# EAGLE design ESP32-S2_pacman (EAGLE 6.5.0)
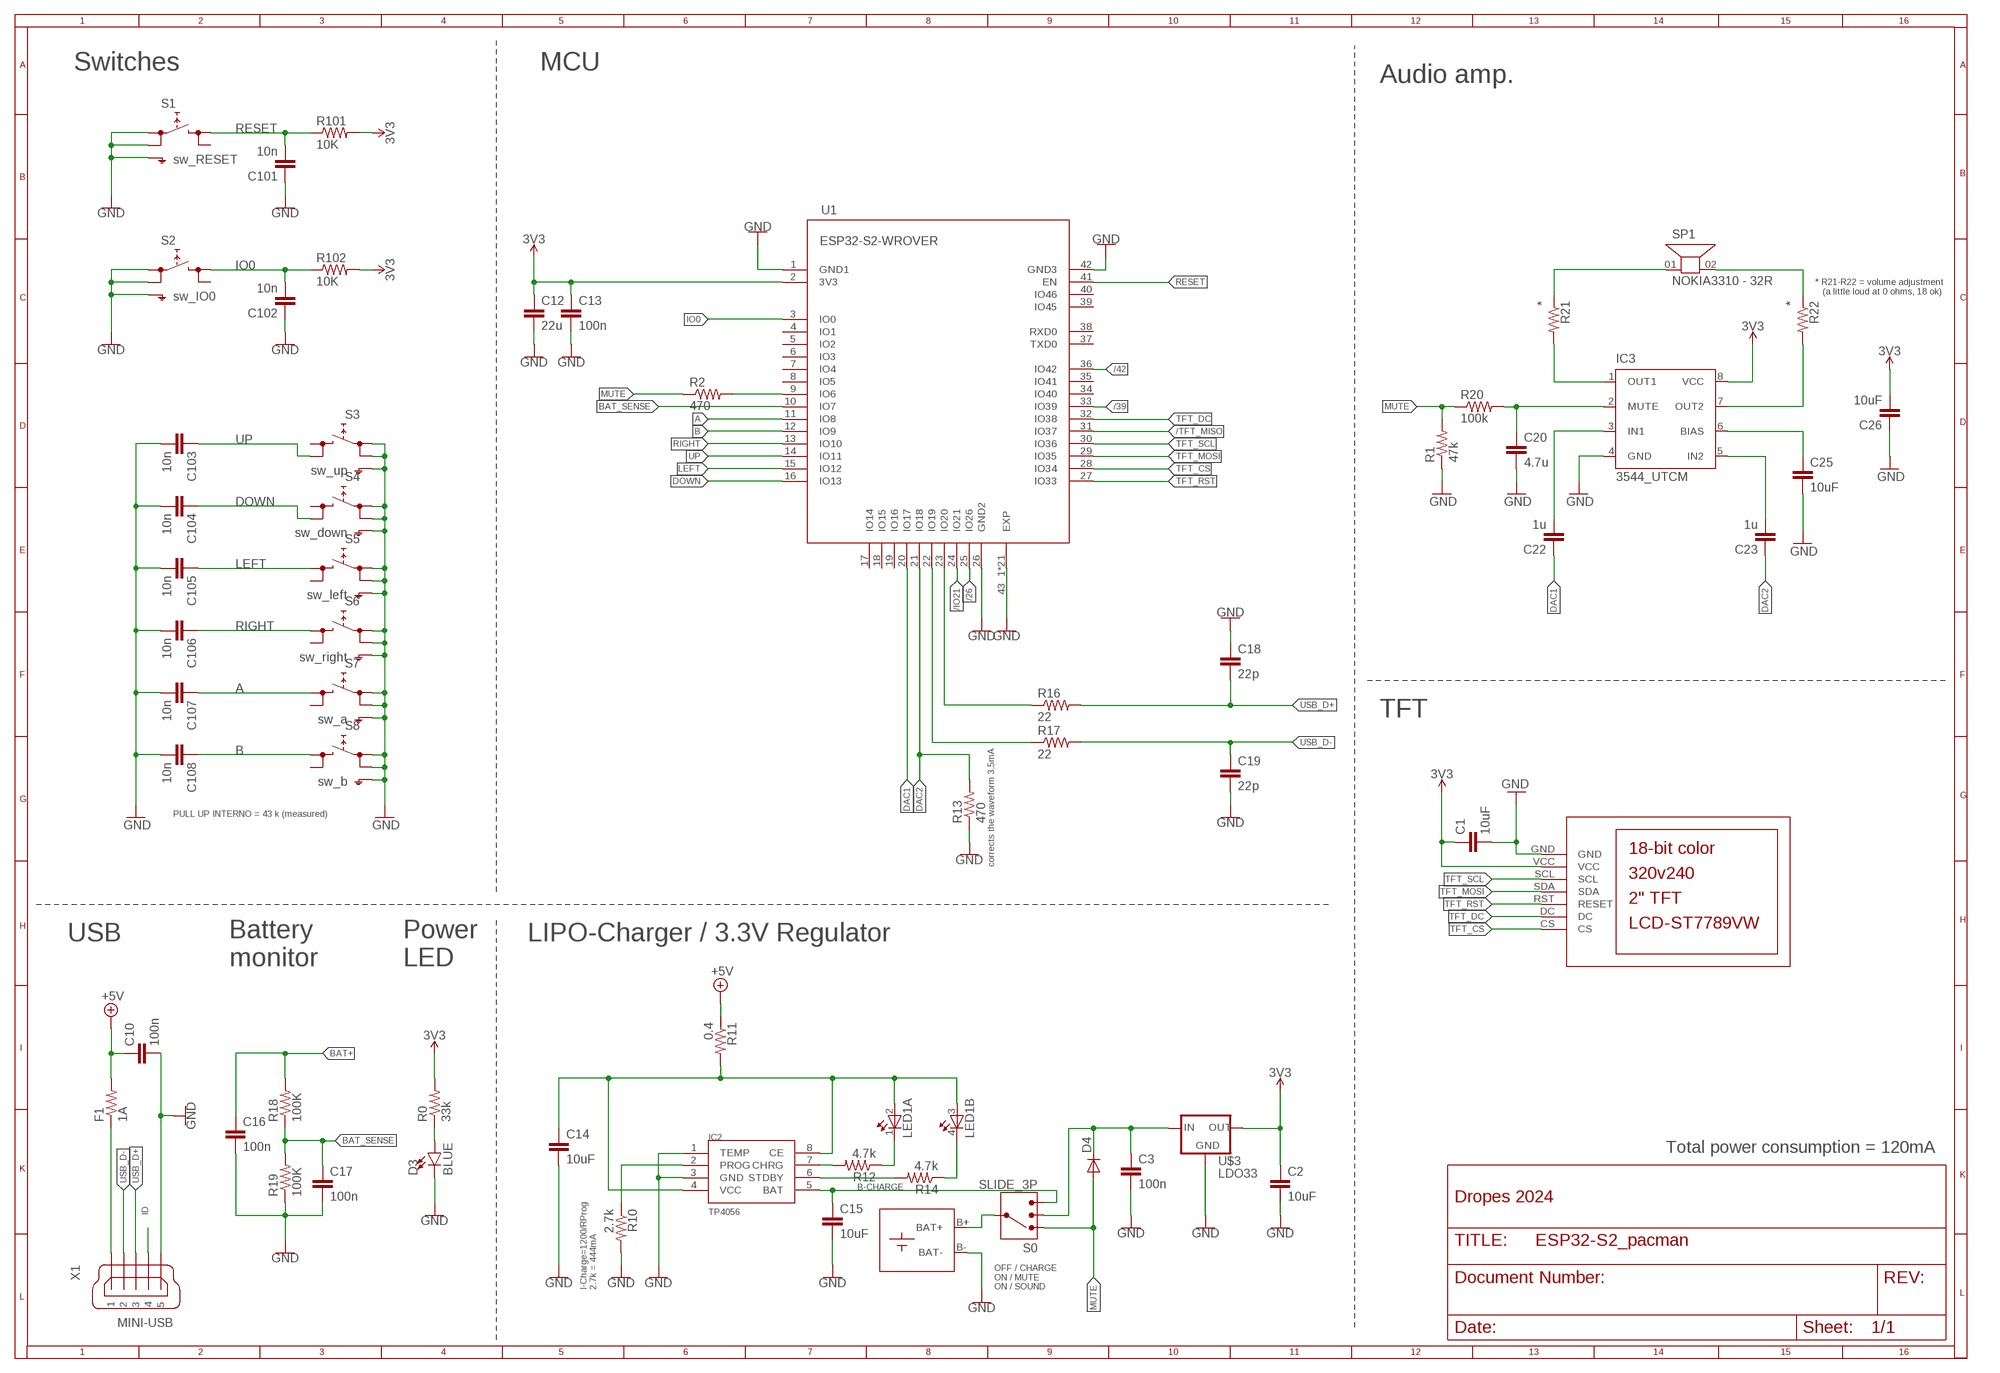
[diagram p0: schematic, sheet 1]

## Parts
C1  10uF  CAP1206  [1206]
C2  10uF  CAP1206  [1206]
C3  100n  CAP0805  [0805]
C10  100n  CAP0805  [0805]
C12  22u  CAP1206  [1206]
C13  100n  CAP0805  [0805]
C14  10uF  CAP1206  [1206]
C15  10uF  CAP1206  [1206]
C16  100n  CAP0805  [0805]
C17  100n  CAP0805  [0805]
C18  22p  CAP0805  [0805]
C19  22p  CAP0805  [0805]
C20  4.7u  CAP0805  [0805]
C22  1u  CAP0805  [0805]
C23  1u  CAP0805  [0805]
C25  10uF  CAP0805  [0805]
C26  10uF  CAP0805  [0805]
C101  10n  CAP0805  [0805]
C102  10n  CAP0805  [0805]
C103  10n  CAP0805  [0805]
C104  10n  CAP0805  [0805]
C105  10n  CAP0805  [0805]
C106  10n  CAP0805  [0805]
C107  10n  CAP0805  [0805]
C108  10n  CAP0805  [0805]
D3  BLUE  LED-BLUE1206  [LED-1206]
D4  DIODE-SOD323-W  [SOD323-W]
F1  1A  RESISTOR0805-RES  [0805]
IC2  TP4056  [SOP-8]
IC3  3544_UTCM  [SO08]
LED1  TOPLED-2--  [P-LCC-4-2]
R0  33k  RESISTOR0805-RES  [0805]
R1  47k  RESISTOR0805-RES  [0805]
R2  470  RESISTOR0805-RES  [0805]
R10  2.7k  RESISTOR0805-RES  [0805]
R11  0.4  RESISTOR0805-RES  [0805]
R12  4.7k  RESISTOR0805-RES  [0805]
R13  470  RESISTOR0805-RES  [0805]
R14  4.7k  RESISTOR0805-RES  [0805]
R16  22  RESISTOR0805-RES  [0805]
R17  22  RESISTOR0805-RES  [0805]
R18  100K  RESISTOR0805-RES  [0805]
R19  100K  RESISTOR0805-RES  [0805]
R20  100k  RESISTOR0805-RES  [0805]
R21  *  RESISTOR0805-RES  [0805]
R22  *  RESISTOR0805-RES  [0805]
R101  10K  RESISTOR0805-RES  [0805]
R102  10K  RESISTOR0805-RES  [0805]
S0  SLIDE_3P  [SLIDE_3P]
S1  sw_RESET  SKHMPSE010  [SKHMPXE010]
S2  sw_IO0  SKHMPSE010  [SKHMPXE010]
S3  sw_up  SKHMPSE010  [SKHMPXE010]
S4  sw_down  SKHMPSE010  [SKHMPXE010]
S5  sw_left  SKHMPSE010  [SKHMPXE010]
S6  sw_right  SKHMPSE010  [SKHMPXE010]
S7  sw_a  SKHMPSE010  [SKHMPXE010]
S8  sw_b  SKHMPSE010  [SKHMPXE010]
SP1  NOKIA3310 - 32R  AL201P  [AL201P]
U1  ESP32-S2-WROVER  [MODULE_ESP32-S2-WROVER]
U$1  NOKIA_LIPO  [BATTERY]
U$2  LCD-ST7789VW  [LCD-ST7789VW]
U$3  LDO33  [SOT89R]
X1  MINI-USB  MINI-USB-32005-301  [32005-301]

## Nets
+5V [+5V]: C10.1 F1.2 R11.1
/26: U1.25(IO26)
/39: U1.33(IO39)
/42: U1.36(IO42)
/IO21: U1.24(IO21)
/TFT_MISO: U1.31(IO37)
A: C107.1 S7.3(2.1) U1.11(IO8)
B: C108.1 S8.3(2.1) U1.12(IO9)
B-CHARGE [3V3]: C15.1 IC2.5(BAT) S0.P$4
BAT+ [3V3]: C16.1 R18.2 S0.P$1 U$1.B+(BAT+)
BAT++: C3.1 D4.C S0.P$3 U$3.2(IN) U$3.'2(IN)
BAT_SENSE: C17.1 R18.1 R19.2 U1.10(IO7)
DAC1: C22.1 U1.20(IO17)
DAC2: C23.1 R13.2 U1.21(IO18)
DOWN: C104.1 S4.4(2.2) U1.16(IO13)
GND [GND]: C1.2 C2.2 C3.2 C10.2 C12.2 C13.2 C14.2 C15.2 C16.2 C17.2 C18.1 C19.2 C20.2 C25.2 C26.1 C101.1 C102.1 C103.2 C104.2 C105.2 C106.2 C107.2 C108.2 D3.C IC2.1(TEMP) IC2.3(GND) IC3.4(GND) R1.1 R10.2 R13.1 R19.1 S1.1(1.1) S1.2(1.2) S1.5(SH) S2.1(1.1) S2.2(1.2) S2.5(SH) S3.1(1.1) S3.2(1.2) S3.5(SH) S4.1(1.1) S4.2(1.2) S4.5(SH) S5.1(1.1) S5.2(1.2) S5.5(SH) S6.1(1.1) S6.2(1.2) S6.5(SH) S7.1(1.1) S7.2(1.2) S7.5(SH) S8.1(1.1) S8.2(1.2) S8.5(SH) U1.1(GND1) U1.26(GND2) U1.42(GND3) U1.43_1(EXP) U1.43_2(EXP) U1.43_3(EXP) U1.43_4(EXP) U1.43_5(EXP) U1.43_6(EXP) U1.43_7(EXP) U1.43_8(EXP) U1.43_9(EXP) U1.43_10(EXP) U1.43_11(EXP) U1.43_12(EXP) U1.43_13(EXP) U1.43_14(EXP) U1.43_15(EXP) U1.43_16(EXP) U1.43_17(EXP) U1.43_18(EXP) U1.43_19(EXP) U1.43_20(EXP) U1.43_21(EXP) U$1.B-(BAT-) U$2.GND U$3.1(GND) X1.5
ID: X1.4
IN1: C22.2 IC3.3(IN1)
IO0: C102.2 R102.1 S2.3(2.1) U1.3(IO0)
IO52: R16.1 U1.23(IO20)
IO53: R17.1 U1.22(IO19)
LEFT: C105.1 S5.3(2.1) U1.15(IO12)
MUTE [3V3]: D4.A R1.2 R2.1 R20.1 S0.P$2
N$1: R21.1 SP1.01
N$2: D3.A R0.1
N$4: C20.1 IC3.2(MUTE) R20.2
N$6: R2.2 U1.9(IO6)
N$19: R22.1 SP1.02
N$31: IC3.1(OUT1) R21.2
N$32: C25.1 IC3.6(BIAS)
N$33: IC3.7(OUT2) R22.2
N$34: C23.2 IC3.5(IN2)
N$38: IC2.2(PROG) R10.1
N$39: IC2.7(CHRG) R12.2
N$40: IC2.6(STDBY) R14.2
N$41: LED1.1(A:C) R12.1
N$42: LED1.4(B:C) R14.1
N$43: C14.1 IC2.4(VCC) IC2.8(CE) LED1.2(A:A) LED1.3(B:A) R11.2
RESET: C101.2 R101.1 S1.3(2.1) U1.41(EN)
RIGHT: C106.1 S6.3(2.1) U1.13(IO10)
TFT_CS: U1.28(IO34) U$2.CS
TFT_DC: U1.32(IO38) U$2.DC
TFT_MOSI: U1.29(IO35) U$2.SDA
TFT_RST: U1.27(IO33) U$2.RST(RESET)
TFT_SCL: U1.30(IO36) U$2.SCL
UP: C103.1 S3.4(2.2) U1.14(IO11)
USB+ [+5V]: F1.1 X1.1
USB_D+: C18.2 R16.2 X1.3
USB_D-: C19.1 R17.2 X1.2
VCC [3V3]: C1.1 C2.1 C12.1 C13.1 C26.2 IC3.8(VCC) R0.2 R101.2 R102.2 U1.2(3V3) U$2.VCC U$3.3(OUT) ; supply symbol labelled 3V3
Unconnected: S1.4(2.2) S2.4(2.2) S3.3(2.1) S4.3(2.1) S5.4(2.2) S6.4(2.2) S7.4(2.2) S8.4(2.2) U1.4(IO1) U1.5(IO2) U1.6(IO3) U1.7(IO4) U1.8(IO5) U1.17(IO14) U1.18(IO15) U1.19(IO16) U1.34(IO40) U1.35(IO41) U1.37(TXD0) U1.38(RXD0) U1.39(IO45) U1.40(IO46)

## Notes on the sheet
- Switches | MCU
- Audio amp.
- * R21-R22 = volume adjustment
     (a little loud at 0 ohms, 18 ok)
- TFT
- PULL UP INTERNO = 43 k (measured)
- corrects the waveform 3.5mA
- USB | LIPO-Charger / 3.3V Regulator
- Battery
  monitor
- Power
  LED
- Total power consumption = 120mA
- Dropes 2024
- I-Charge=1200/RProg
  2.7k = 444mA
- OFF / CHARGE
  ON / MUTE
  ON / SOUND

## Library data of the parts
C1-C3 C10 C12-C20 C22 C23 C25 C26 C101-C108 = SparkFun:CAP: Capacitor Standard 0603 ceramic capacitor, and 0.1" leaded capacitor.
D3 = SparkFun-LED:LED-BLUE: Blue SMD LED Used in manufacturing of various products at SparkFun Packages: 0603 - SMD 0603 package [Product Link] <http://www.digikey.com/product-detail/en/SMLE12BC7TT86/511-1589-2-ND/1641808> 1206 - SMD1206 package [Product Link] <http://www.digikey.com/product-detail/en/lite-on-inc/LTST-C150TBKT/160-1643-1-ND/573584> SparkFun Products: ESP8266 Thing-Dev Board <https://www.sparkfun.com/products/13711> RedBoard <https://www.sparkfun.com/products/12757>; PROD_ID: DIO-09911
D4 = diode:DIODE-: DIODE
F1 R0 R1 R2 R10-R14 R16-R22 R101 R102 = SparkFun:RESISTOR: Resistor Basic schematic elements and footprints for 0603, 1206, and PTH resistors.
IC2 = TP4056:TP4056
IC3 = 3544_UTC:3544_UTC: Dual headphone amplifie Source: https://datasheetspdf.com/pdf-file/577610/UTC/3544/1
LED1 = led:TOPLED-2-: Multi TOPLED® (two color) LG T672, LP T672 LSY T67B LSW T67C LSY T675 LSY T676 LSG T677 LSG T770 Source: http://www.osram.convergy.de/
S0 = switch:SLIDE_3P
S1-S8 = switch:SKHMP*E010: 6.2 X 6.5mm TACT Switch (SMD) Source: http://www3.alps.co.jp/WebObjects/catalog.woa/PDF/E/Switch/Tact/SKHM/SKHM.PDF
SP1 = buzzer:AL201P: SPEAKER Source: Buerklin; OC_FARNELL: unknown; OC_NEWARK: unknown
U1 = ESP32-S2-WROVER v-real:ESP32-S2-WROVER: WiFi 802.11b/g/n Transceiver Module 2.4GHz Antenna Not Included Surface Mount Check prices <https://pricing.snapeda.com/parts/ESP32-S2-WROVER/Espressif%20Systems/view-part?ref=eda>; AVAILABILITY: Bad; DESCRIPTION: WiFi 802.11b/g/n Transceiver Module 2.4GHz Antenna Not Included Surface Mount; MF: Espressif Systems; MP: ESP32-S2-WROVER; PACKAGE: VFQFN-56 Espressif Systems; PRICE: None
U$1 = dropes:NOKIA_LIPO
U$2 = galvo 6:LCD-ST7789VW
U$3 = v-reg:LDO33
X1 = m140_attiny_V5:MINI-USB-: MINI USB-B Conector Source: www.cypressindustries.com; OC_FARNELL: unknown; OC_NEWARK: unknown

## Net classes
1 VBUS: width 0.61 mm
2 3V3: width 0.61 mm
3 VCC: width 0.61 mm
4 GND: width 0.406 mm
5 +5V: width 0.61 mm

## Board
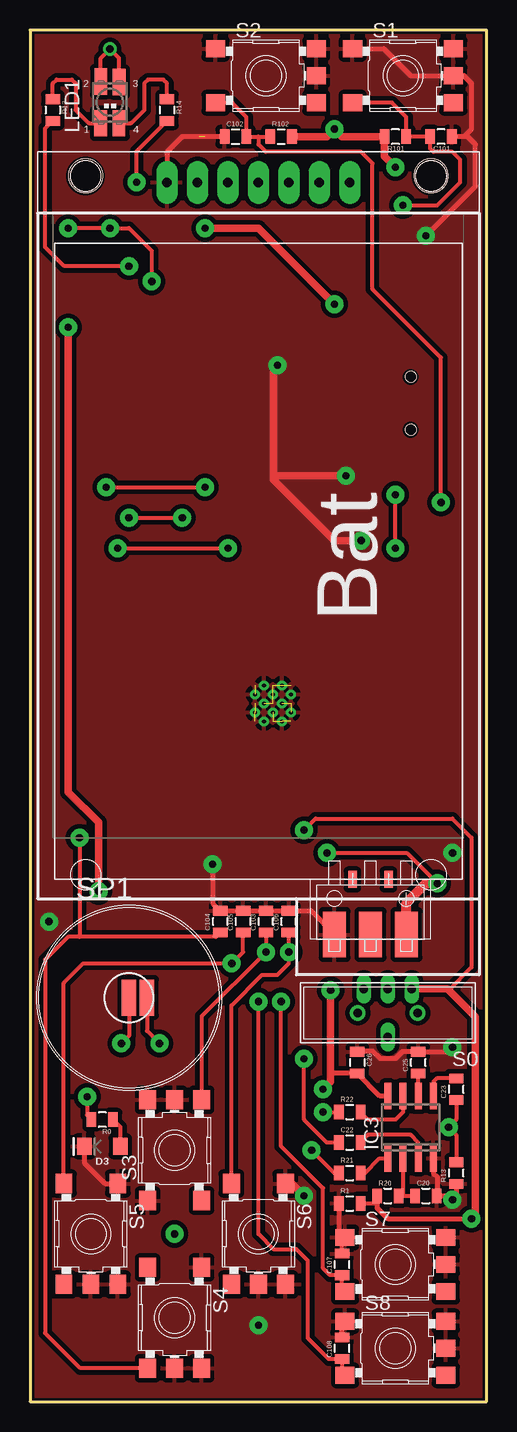
[diagram p1: board, top side]
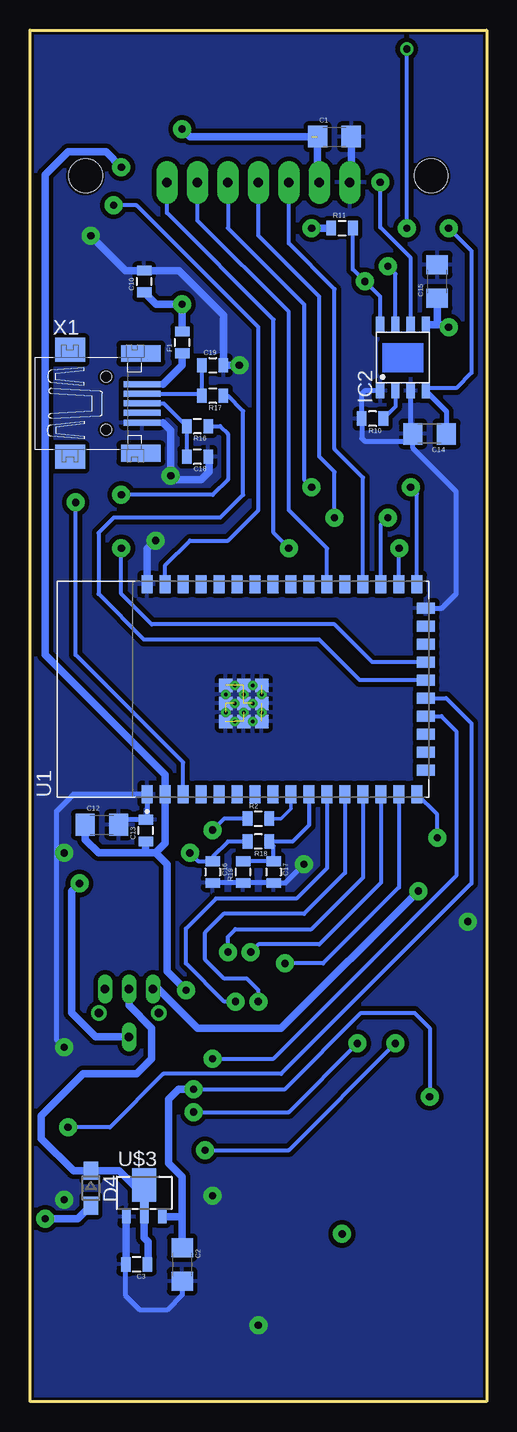
[diagram p2: board, bottom side, seen from below]

Size 38.1 x 114.3 mm. Coordinates in mm from the lower left corner, seen from the top.
Outline: 38.1,0 38.1,114.3 0,114.3 0,0 38.1,0
Copper layers (1*16): Top 0.035mm / dielectric 1.5mm / Bottom 0.035mm
Design rules "SparkFun-2-layer-STANDARD *": minimum track width 10mil, minimum drill 20mil, track to track 15mil, track to pad 15mil, pad to pad 15mil, via to via 15mil, smd to smd 8mil, copper to edge 8mil, drill to drill 8mil, minimum pad ring 10mil, minimum via ring 10mil, stop-mask expansion 4mil, vias tented up to drill 25mil, thermal gap 15mil
Holes 2.8 mm at 4.64,102.15 33.46,102.15

### Footprints (pad centres in the part's own frame; a part is rotated, then mirrored left to right if it is on the bottom)
1206 = smd 1.6 x 1.8: 1 -1.4,0; 2 1.4,0
0805 = smd 0.8 x 1.2: 1 -0.9,0; 2 0.9,0
LED-1206 = smd 1.2 x 1.4: A -1.5,0; C 1.5,0
SOD323-W = smd 1.5 x 1.2: A 1.45,0; C -1.45,0
SOP-8 = smd 1.3 x 0.7: 1 -2.75,1.905; 2 -2.75,0.635; 3 -2.75,-0.635; 4 -2.75,-1.905; 5 2.75,-1.905; 6 2.75,-0.635; 7 2.75,0.635; 8 2.75,1.905
SO08 = smd 0.6 x 2.2: 1 -1.905,-2.6; 2 -0.635,-2.6; 3 0.635,-2.6; 4 1.905,-2.6; 5 1.905,2.6; 6 0.635,2.6; 7 -0.635,2.6; 8 -1.905,2.6
P-LCC-4-2 = smd 1.067 x 2.184: 1 -0.76,-1.73; 2 -0.755,1.735; 3 0.76,1.7; 4 0.75,-1.73
SLIDE_3P = drill 0.7 long: P$1 0,2; P$2 -2,-2; P$3 0,-2; P$4 2,-2 | drill 0.7 pad 1.3: P$5 -2.5,0; P$6 2.5,0
SKHMPXE010 = smd 1.6 x 1.4: 1 -4.2,2.25; 2 4.2,2.25; 3 -4.2,-2.25; 4 4.2,-2.25; 5 4.2,0
AL201P = smd 1.2 x 3: 01 0,0; 02 1.5,0
MODULE_ESP32-S2-WROVER = smd 1.5 x 0.9: 1 -8.75,8; 2 -8.75,6.5; 3 -8.75,5; 4 -8.75,3.5; 5 -8.75,2; 6 -8.75,0.5; 7 -8.75,-1; 8 -8.75,-2.5; 9 -8.75,-4; 10 -8.75,-5.5; 11 -8.75,-7; 12 -8.75,-8.5; 13 -8.75,-10; 14 -8.75,-11.5; 15 -8.75,-13; 16 -8.75,-14.5; 27 8.75,-14.5; 28 8.75,-13; 29 8.75,-11.5; 30 8.75,-10; 31 8.75,-8.5; 32 8.75,-7; 33 8.75,-5.5; 34 8.75,-4; 35 8.75,-2.5; 36 8.75,-1; 37 8.75,0.5; 38 8.75,2; 39 8.75,3.5; 40 8.75,5; 41 8.75,6.5; 42 8.75,8 | smd 0.9 x 1.5: 17 -6.75,-15.25; 18 -5.25,-15.25; 19 -3.75,-15.25; 20 -2.25,-15.25; 21 -0.75,-15.25; 22 0.75,-15.25; 23 2.25,-15.25; 24 3.75,-15.25; 25 5.25,-15.25; 26 6.75,-15.25 | smd 1.1 x 1.1: 43_1 -2.69,1.45; 43_2 -1.19,1.45; 43_3 0.31,1.45; 43_4 -2.69,-0.05; 43_5 -1.19,-0.05; 43_6 0.31,-0.05; 43_7 -2.69,-1.55; 43_8 -1.19,-1.55; 43_9 0.31,-1.55 | drill 0.3 pad 0.406: 43_10 -1.94,1.45; 43_11 -0.44,1.45; 43_12 -2.69,0.7; 43_13 -1.19,0.7; 43_14 0.31,0.7; 43_15 -1.94,-0.05; 43_16 -0.44,-0.05; 43_17 -2.69,-0.8; 43_18 -1.19,-0.8; 43_19 0.31,-0.8; 43_20 -1.94,-1.55; 43_21 -0.44,-1.55
BATTERY = smd 3.81 x 1.93: B+ 30.93,12.355; B- 30.93,6.355; NC 30.93,9.355 | smd 1.422 x 0.711: P$1 26.33,10.855; P$2 26.33,7.855
LCD-ST7789VW = drill 0.8 pad 1.778 long: CS -29.21,7.62; DC -29.21,5.08; GND -29.21,-7.62; RST -29.21,2.54; SCL -29.21,-2.54; SDA -29.21,0; VCC -29.21,-5.08
SOT89R = smd 0.7 x 1.1: 1 -1.5,-1.75; 3 1.5,-1.75 | smd 0.7 x 1.8: 2 0,-1.4 | smd 2 x 2.8: '2 0,0.9
32005-301 = smd 3.1 x 0.5: 1 3,1.6; 2 3,0.8; 3 3,0; 4 3,-0.8; 5 3,-1.6 | smd 2.5 x 2: M1 -3,-4.45; M2 -3,4.45 | smd 3.3 x 1.4: M3 2.9,4.15; M4 2.9,-4.15 | hole 0.9: 0,2.2; 0,-2.2

### Placement (x,y rotation side)
C1  12.7,105.41 0 bottom
C2  25.4,11.43 270 bottom
C3  29.21,11.43 180 bottom
C10  28.57,93.34 90 bottom
C12  32.1,48.07 0 bottom
C13  28.45,47.59 90 bottom
C14  4.76,80.65 180 bottom
C15  4.13,93.34 90 bottom
C16  22.86,44.13 270 bottom
C17  17.78,44.13 270 bottom
C18  24.13,78.74 180 bottom
C19  22.86,86.36 0 bottom
C20  33.02,17.14 0 top
C22  26.67,21.59 0 top
C23  35.56,26.04 90 top
C25  32.38,28.26 90 top
C26  27.3,28.26 270 top
C101  34.29,105.41 180 top
C102  17.14,105.41 0 top
C103  19.69,40 90 top
C104  15.87,40 90 top
C105  17.78,40 90 top
C106  21.59,40 90 top
C107  26.04,11.43 90 top
C108  26.04,4.45 90 top
D3  6.03,21.27 180 top
D4  33.02,17.78 270 bottom
F1  25.4,88.27 90 bottom
IC2  6.98,87 90 bottom
IC3  31.75,22.86 0 top
LED1  6.67,108.27 0 top
R0  6.03,23.5 180 top
R1  26.67,16.51 0 top
R2  19.05,48.58 0 bottom
R10  9.53,81.92 180 bottom
R11  12.06,97.79 0 bottom
R12  1.9,107.63 270 top
R13  35.56,19.05 90 top
R14  11.43,107.63 270 top
R16  24.13,81.28 180 bottom
R17  22.86,83.82 180 bottom
R18  19.05,46.67 180 bottom
R19  20.32,44.13 90 bottom
R20  29.85,17.14 0 top
R21  26.67,19.05 0 top
R22  26.67,24.13 0 top
R101  30.48,105.41 180 top
R102  20.96,105.41 0 top
S0  29.85,32.39 180 top
S1  31.11,110.49 0 top
S2  19.69,110.49 0 top
S3  12.06,20.95 90 top
S4  12.06,6.98 270 top
S5  5.08,13.97 270 top
S6  19.05,13.97 270 top
S7  30.48,11.43 0 top
S8  30.48,4.45 0 top
SP1  8.25,33.66 0 top
U1  20.32,59.37 90 bottom
U$1  19.05,69.85 270 top
U$2  19.05,72.39 270 top
U$3  28.57,17.14 0 bottom
X1  31.75,83.19 0 bottom

### Tracks (layer width: path | path; a pad name or v marks a point on that pad's centre or on a via)
+5V  (via drill 0.6 pad 1.5)
  Top 0.61: v14.6,97.79 19.05,97.79 v25.4,91.44
  Bottom 0.61: C10.1 27.57,91.44 v25.4,91.44 F1.2 | v14.6,97.79 R11.1
A  (via drill 0.6 pad 1.5)
  Top 0.35: v20.96,33.34 20.96,21.27 24.45,17.78 24.45,11.11 25.03,10.53 C107.1 26.04,9.18 S7.3
  Bottom 0.35: U1.11 13.32,44.47 15.87,41.91 22.6,41.91 25.08,39.42 25.08,36.51 21.91,33.34 v20.96,33.34
B  (via drill 0.6 pad 1.5)
  Top 0.35: v19.05,33.34 19.05,13.97 20.32,12.7 22.23,12.7 23.18,11.75 23.18,5.3 24.93,3.54 C108.1 26.04,2.44 S8.3
  Bottom 0.35: U1.12 11.82,44.06 15.24,40.64 21.96,40.64 23.5,39.11 23.5,36.83 21.91,35.24 20,35.24 19.05,34.29 v19.05,33.34
B-CHARGE  (via drill 0.6 pad 1.5)
  Top 0.61: v5.71,42.55 5.71,48.26 3.18,50.8 v3.18,89.53
  Bottom 0.61: v5.71,42.55 17.14,31.11 24.13,31.11 27.4,34.39 S0.P$4 | IC2.5 4.13,89.75 | 4.13,89.75 3.39,89.75 v3.18,89.53 | C15.1 4.13,89.75
BAT+  (via drill 0.6 pad 1.5)
  Top 0.35: v24.77,45.72 31.43,45.72 v33.97,43.18
  Top 0.813: U$1.B+ 31.41,41.56 33.02,43.18 v33.97,43.18
  Bottom 0.35: R18.2 21.59,46.67 22.86,45.4 C16.1 24.08,45.03 v24.77,45.72
  Bottom 0.61: v33.97,43.18 34.61,42.55 34.61,32.39 32.61,30.39 S0.P$1
BAT++
  Bottom 0.406: U$3.2 U$3.'2
  Bottom 0.61: S0.P$3 29.85,33.02 27.94,31.11 27.94,28.57 29.21,27.31 33.66,27.31 37.15,23.81 37.15,21.91 34.47,19.23 D4.C 30.66,19.23 29.47,18.04 U$3.'2 | U$3.2 28.57,13.65 28.26,13.34 28.26,11.48 C3.1
BAT_SENSE
  Bottom 0.35: U1.10 14.82,48.05 16.19,46.67 R18.1 17.78,46.3 C17.1 R19.2
DAC1  (via drill 0.6 pad 1.5)
  Top 0.35: C22.1 24.77,21.59 22.86,23.5 v22.86,28.57
  Bottom 0.35: U1.20 3.78,57.12 2.54,55.88 2.54,43.81 17.78,28.57 v22.86,28.57
DAC2  (via drill 0.6 pad 1.5)
  Top 0.35: R13.2 35.56,22.22 v34.92,22.86 35.56,23.5 C23.1
  Bottom 0.35: U1.21 3.38,58.62 1.27,56.52 1.27,43.18 17.14,27.31 26.99,27.31 31.43,22.86 v34.92,22.86
DOWN  (via drill 0.6 pad 1.5)
  Top 0.35: S4.4 4.2,2.79 1.27,5.71 1.27,36.83 3.18,38.73 4.13,38.73 | v4.13,46.99 4.13,38.73 | C104.1 15.51,38.73 4.13,38.73
  Bottom 0.35: v4.13,46.99 4.13,48.93 U1.16
GND  (via drill 0.6 pad 1.5)  (13 unrouted)
  Top 0.35: C107.2 26.04,13.43
  Top 0.406: S1.1 29.5,112.74 31.75,110.49 S1.5 36.2,110.49 36.83,109.86 36.83,106.05 36.2,105.41 | R1.1 25.77,14.19 S7.1 26.04,13.43 | U$1.B- 23.42,40.91 C106.2 C103.2 C105.2 C104.2 15.24,41.54 v15.24,44.77 | C108.2 26.04,6.45 S8.1 | D3.C 4.53,19.91 6.28,18.17 S5.1 | v35.24,29.53 34.87,29.16 C25.2 31.06,29.16 30.48,28.57 29.21,28.57 28.57,29.21 27.36,29.21 C26.1 | C102.1 12.7,105.41 11.43,104.14 U$2.GND | R13.1 35.56,17.14 v35.24,16.83 34.92,17.14 C20.2 33.97,17.2 33.97,18.73 33.66,19.05 IC3.4 | v33.02,97.16 37.15,101.28 37.15,104.78 36.51,105.41 36.2,105.41 | 36.2,105.41 C101.1
  Top 0.61: v27.62,71.76 25.4,71.76 20.32,76.84 | 20.32,76.84 20.32,86.04 v20.64,86.36 | v26.35,77.15 20.64,77.15 20.32,76.84 | S6.1 21.84,18.17 v22.86,17.14
  Bottom 0.35: X1.5 26.98,81.59
  Bottom 0.406: U1.26 3.73,66.12 2.54,67.31 2.54,75.83 6.16,79.45 6.16,80.01 | IC2.1 10.16,84.25 10.42,83.98 R10.2 10.42,80.28 10.16,80.01 6.16,80.01 | v35.24,29.53 35.88,30.16 35.88,45.72 | 35.88,45.72 35.88,49.21 34.47,50.62 U1.1 28.32,48.62 C13.2 30.28,48.49 C12.2 | 6.16,80.01 C14.2 6.35,80.83 IC2.3 | 35.88,45.72 v35.24,45.72 35.24,45.4 | v15.24,44.77 16.78,43.23 C17.2 R19.1 C16.2 | C2.2 25.4,8.89 26.67,7.62 28.89,7.62 30.11,8.84 C3.2
  Bottom 0.61: v20.64,86.36 C19.2 21.96,90.54 25.67,94.25 C10.2 30.11,94.25 v33.02,97.16 | 26.98,81.59 26.35,80.96 v26.35,77.15 26.04,76.84 23.81,76.84 23.18,77.47 23.18,78.69 C18.1 | U1.42 28.32,71.06 v27.62,71.76 | U$2.GND 11.3,101.73 C1.2 | U$3.1 30.07,11.46 C3.2
  other vias: 1.59,40 19.05,6.35
  pour Bottom: 0,0 0,114.3 38.1,114.3 38.1,0
  pour Top: 0,0 0,114.3 38.1,114.3 38.1,0
IN1
  Top 0.35: IC3.3 32.38,21.59 31.75,22.22 28.21,22.22 C22.2
IO0  (via drill 0.6 pad 1.5)
  Top 0.35: 19.05,105.41 C102.2 18.05,107.05 16.86,108.24 S2.3 | 19.05,105.41 R102.1 | v34.29,74.93 34.29,87 28.57,92.71 28.57,103.19 27.62,104.14 19.69,104.14 19.05,104.78 19.05,105.41
  Bottom 0.35: U1.3 25.32,53.26 34.29,62.23 v34.29,74.93
IO52  (via drill 0.6 pad 1.5)
  Top 0.35: v30.48,71.12 v30.48,75.56
  Bottom 0.35: U1.23 9.55,61.62 12.7,64.77 27.94,64.77 30.48,67.31 v30.48,71.12 | R16.1 22.23,81.28 21.59,80.65 21.59,76.84 22.86,75.56 v30.48,75.56
IO53
  Bottom 0.35: U1.22 10.59,60.12 13.97,63.5 28.57,63.5 32.38,67.31 32.38,72.39 31.11,73.66 22.23,73.66 20.32,75.56 20.32,82.55 21.59,83.82 R17.1
LEFT  (via drill 0.6 pad 1.5)
  Top 0.35: S5.3 2.83,34.9 4.45,36.51 v16.83,36.51 17.78,37.47 C105.1
  Bottom 0.35: U1.15 7.32,42.84 13.65,36.51 v16.83,36.51
MUTE  (via drill 0.6 pad 1.5)
  Top 0.35: R20.1 28.95,16.51 R1.2 | v22.86,47.62 23.81,48.58 35.24,48.58 36.83,46.99 36.83,36.19 34.92,34.29
  Top 0.406: 28.95,16.51 28.95,16.14 29.85,15.24 v36.83,15.24
  Top 0.61: S0.P$2 34.83,34.39 34.92,34.29 37.15,32.07 37.15,15.24 v36.83,15.24
  Bottom 0.35: R2.1 21.91,48.58 v22.86,47.62
  Bottom 0.61: D4.A 34.11,15.24 v36.83,15.24
N$1  (via drill 0.6 pad 1.5)
  Top 0.35: SP1.01 8.25,30.48 v7.62,29.85 | v23.5,20.95 25.4,19.05 R21.1
  Bottom 0.35: v23.5,20.95 16.51,20.95 v7.62,29.85
N$2
  Top 0.35: R0.1 7.53,22.89 D3.A
N$4
  Top 0.35: R20.2 31.11,17.14 | 31.11,17.14 C20.1 | IC3.2 31.11,17.14
N$5  (via drill 0.6 pad 1.5)
  other vias: 12.06,13.97
N$6
  Bottom 0.305: U1.9 16.32,49.4 17.14,48.58 R2.2
N$19  (via drill 0.6 pad 1.5)
  Top 0.35: SP1.02 9.75,30.89 v10.79,29.85 | v24.45,24.13 R22.1
  Bottom 0.35: v24.45,24.13 16.51,24.13 v10.79,29.85
N$31
  Top 0.35: R21.2 27.94,19.05 29.15,20.26 IC3.1
N$32
  Top 0.35: IC3.6 C25.1
N$33
  Top 0.35: IC3.7 31.11,24.13 30.48,23.5 28.21,23.5 R22.2
N$34
  Top 0.35: C23.2 33.92,26.93 33.66,26.67 IC3.5
N$38
  Bottom 0.35: IC2.2 7.62,82.92 R10.1
N$39  (via drill 0.6 pad 1.5)
  Top 0.35: v8.25,94.62 2.86,94.62 1.27,96.2 1.27,106.1 R12.2
  Bottom 0.35: IC2.7 7.62,93.98 v8.25,94.62
N$40  (via drill 0.6 pad 1.5)
  Top 0.35: v8.89,101.6 8.89,104.19 R14.2
  Bottom 0.35: IC2.6 6.35,95.3 8.89,97.84 v8.89,101.6
N$41
  Top 0.35: R12.1 1.9,109.86 2.22,110.17 3.49,110.17 3.81,109.86 3.81,107.63 4.9,106.54 LED1.1
N$42
  Top 0.35: R14.1 11.43,109.86 11.11,110.17 9.84,110.17 9.53,109.86 9.53,107.63 8.43,106.54 LED1.4
N$43  (via drill 0.6, 0.6 pad 1.5)
  Top 0.35: v3.18,97.79 v6.67,97.79 8.25,97.79 10.16,95.89 v10.16,93.34 | LED1.2 5.91,111.96 v6.67,112.71 7.43,111.95 LED1.3
  Bottom 0.35: IC2.8 8.89,92.08 v10.16,93.34 11.16,94.35 R11.2 | v3.18,97.79 1.27,95.89 1.27,85.73 2.54,84.45 4.87,84.45 IC2.4 | v6.67,97.79 v6.67,112.71
  Bottom 0.406: IC2.4 3.36,82.53 C14.1
RESET  (via drill 0.6 pad 1.5)
  Top 0.35: S1.3 30.19,108.24 31.38,107.05 R101.1 C101.2 33.39,104.41 33.66,104.14 35.24,104.14 35.88,103.51 35.88,101.6 33.97,99.7 v31.11,99.7
  Bottom 0.35: v31.11,99.7 29.21,99.7 19.05,89.53 19.05,74.3 21.59,71.76 24.77,71.76 26.82,69.7 U1.41
RIGHT  (via drill 0.6 pad 1.5)
  Top 0.35: C106.1 v21.59,37.47 21.59,36.51 20.64,35.56 19.37,35.56 16.8,32.99 S6.3
  Bottom 0.35: U1.13 10.32,43.66 14.6,39.37 20.96,39.37 21.59,38.73 v21.59,37.47
TFT_CS  (via drill 0.6 pad 1.5)
  Top 0.35: v7.3,71.12 v16.51,71.12
  Bottom 0.35: v16.51,71.12 17.78,72.39 17.78,90.17 26.67,99.06 U$2.CS | U1.28 7.32,71.1 v7.3,71.12
TFT_DC
  Bottom 0.35: U1.32 13.32,71.11 16.51,74.3 16.51,90.81 24.13,98.42 U$2.DC
TFT_MOSI  (via drill 0.6 pad 1.5)
  Top 0.35: v8.25,73.66 v12.7,73.66
  Bottom 0.35: v12.7,73.66 12.7,77.47 13.97,78.74 13.97,92.08 19.05,97.16 U$2.SDA | U1.29 8.82,73.09 v8.25,73.66
TFT_RST  (via drill 0.6 pad 1.5)
  Top 0.35: v6.35,76.2 v14.6,76.2
  Bottom 0.35: U$2.RST 21.59,97.79 15.24,91.44 15.24,76.84 v14.6,76.2 | U1.27 5.82,75.67 v6.35,76.2
TFT_SCL
  Bottom 0.35: U$2.SCL 16.51,96.52 12.7,92.71 12.7,79.38 10.32,77 U1.30
UP  (via drill 0.6 pad 1.5)
  Top 0.35: C103.1 v19.69,37.47 14.31,32.09 S3.4
  Bottom 0.35: U1.14 8.82,43.25 13.97,38.1 19.05,38.1 v19.69,37.47
USB+
  Bottom 0.406: X1.1 26.98,84.78
  Bottom 0.61: 26.98,84.78 25.4,86.36 F1.1
USB_D+
  Bottom 0.35: C18.2 R16.2 26.94,83.19 X1.3
USB_D-
  Bottom 0.35: C19.1 R17.2 23.93,83.98 X1.2
VCC  (via drill 0.6 pad 1.5)  (1 unrouted)
  Top 0.35: v4.76,25.4 4.76,23.86 R0.2
  Top 0.406: IC3.8 29.2,25.46 C26.2 25.14,27.36 25.08,27.31
  Top 0.61: R102.2 24.77,105.41 v25.4,106.05 26.04,105.41 R101.2 29.58,103.77 v30.48,102.87 | v25.08,34.29 25.08,27.31 25.08,26.67 v24.45,26.04
  Bottom 0.35: v24.45,26.04 16.83,26.04 10.48,32.39 6.03,32.39 4.76,31.11 v4.76,25.4
  Bottom 0.61: 14.6,105.41 24.77,105.41 v25.4,106.05 | v30.48,102.87 31.75,104.14 34.92,104.14 36.83,102.23 36.83,62.23 26.82,52.22 U1.2 26.82,46.52 27.62,45.72 | C12.1 33.5,46.84 32.38,45.72 28.57,45.72 | 28.57,45.72 27.62,45.72 | C13.1 28.45,45.84 28.57,45.72 | U$2.VCC 14.1,101.73 C1.1 | v24.45,26.04 25.72,26.04 26.54,25.21 26.54,19.87 25.4,18.73 25.4,15.56 | 27.62,45.72 26.67,44.77 26.67,35.88 v25.08,34.29 | 25.4,15.56 C2.1 | U$3.3 25.56,15.39 25.4,15.56

### Text on the board
tTest: CH | OK | DROPES / 2024